# EAGLE design nRF24L01-Chip-v12 (EAGLE 6.1)
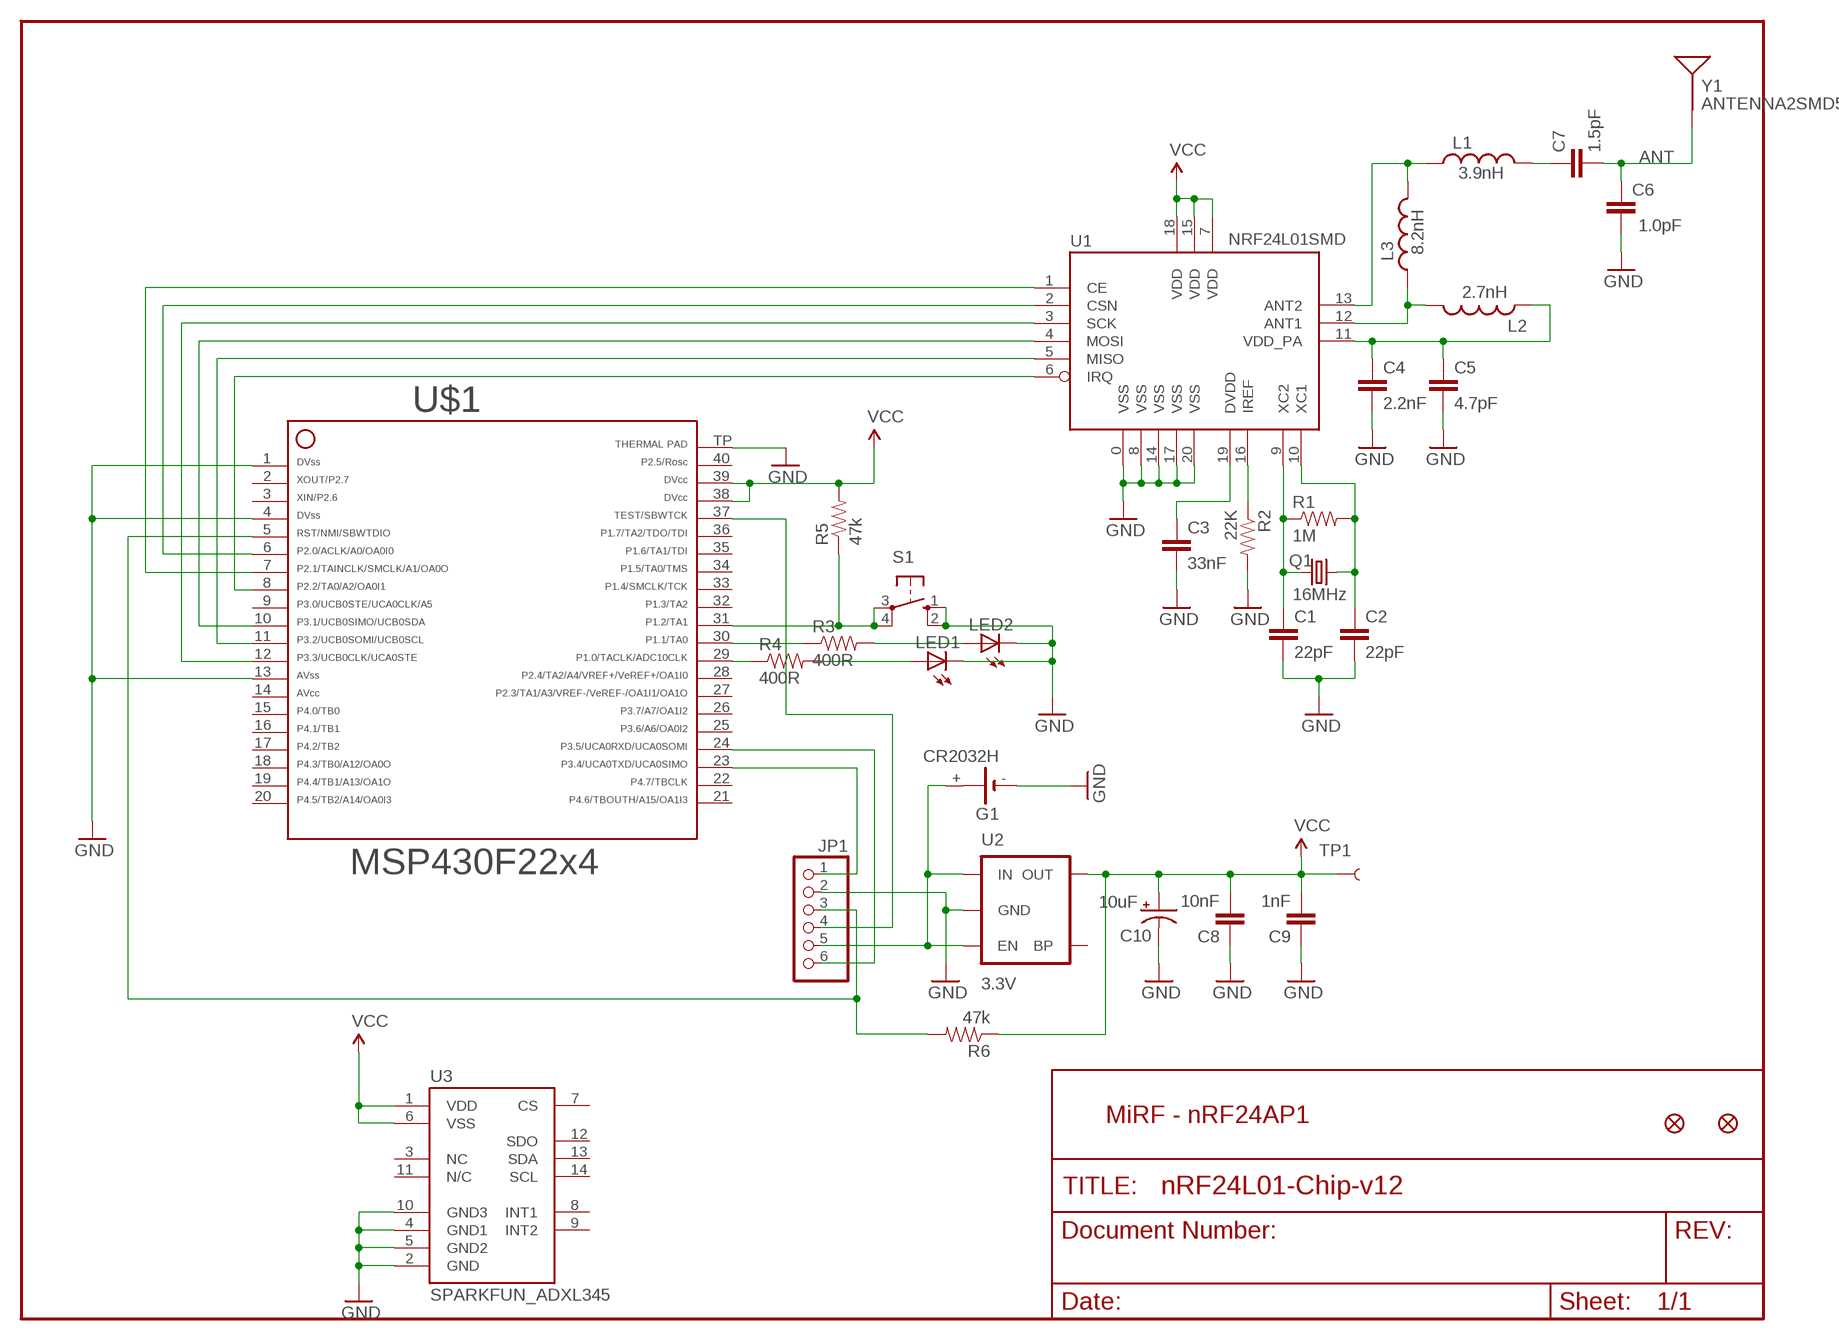
[diagram p0: schematic, sheet 1]

## Parts
C1  22pF  CAP0402  [C0402]
C2  22pF  CAP0402  [C0402]
C3  33nF  CAP0402  [C0402]
C4  2.2nF  CAP0402  [C0402]
C5  4.7pF  CAP0402  [C0402]
C6  1.0pF  CAP0402  [C0402]
C7  1.5pF  CAP0402  [C0402]
C8  10nF  CAP0402  [C0402]
C9  1nF  CAP0402  [C0402]
C10  10uF  CAP_POL1206  [EIA3216]
G1  CR2032H  [CR2032H]
JP1  PINHD-1X6  [1X06]
L1  3.9nH  INDUCTOR0402  [C0402]
L2  2.7nH  INDUCTOR0402  [C0402]
L3  8.2nH  INDUCTOR0402  [C0402]
LED1  LEDCHIPLED_0805  [CHIPLED_0805]
LED2  LEDCHIPLED_0805  [CHIPLED_0805]
Q1  16MHz  CRYSTAL5X3  [CRYSTAL-SMD-5X3]
R1  1M  RESISTOR0402  [C0402]
R2  22K  RESISTOR0402  [C0402]
R3  400R  RESISTOR0402  [C0402]
R4  400R  RESISTOR0402  [C0402]
R5  47k  RESISTOR0402  [C0402]
R6  47k  RESISTOR0402  [C0402]
S1  10-XX  [B3F-10XX]
TP1  TEST-POINT3X5  [PAD.03X.05]
U1  NRF24L01SMD  [QFN20]
U2  3.3V  V_REG_LDOSMD  [SOT23-5]
U3  SPARKFUN_ADXL345  [SPARKFUN_LGA14]
U$1  F22X4---RHA40  [RHA40]
U$2  FIDUCIAL1X2  [FIDUCIAL-1X2]
U$3  FIDUCIAL1X2  [FIDUCIAL-1X2]
Y1  ANTENNA2SMD5  [ANTENNA-CHIP5]

## Nets
ANT: C6.2 C7.2 Y1.FEED(SIGNAL)
GND: C1.2 C2.2 C3.2 C4.2 C5.2 C6.1 C8.1 C9.1 C10.C(-) G1.- JP1.2 LED1.C LED2.C R2.2 S1.1(S) S1.2(S1) U1.0(VSS) U1.8(VSS) U1.14(VSS) U1.17(VSS) U1.20(VSS) U2.2(GND) U3.2(GND) U3.4(GND1) U3.5(GND2) U3.10(GND3) U$1.1 U$1.4 U$1.13 U$1.TP
N$1: C1.1 Q1.1 R1.1 U1.9(XC2)
N$2: C2.1 Q1.3 R1.2 U1.10(XC1)
N$3: L2.2 L3.1 U1.12(ANT1)
N$4: R2.1 U1.16(IREF)
N$5: C3.1 U1.19(DVDD)
N$6: L1.1 L3.2 U1.13(ANT2)
N$7: C4.1 C5.1 L2.1 U1.11(VDD_PA)
N$8: U1.4(MOSI) U$1.10
N$9: C7.1 L1.2
N$10: U1.5(MISO) U$1.11
N$11: U1.3(SCK) U$1.12
N$12: U1.2(CSN) U$1.6
N$13: U1.1(CE) U$1.7
N$14: R4.1 U$1.29
N$15: U1.6(IRQ) U$1.8
N$16: R3.1 U$1.30
N$17: LED2.A R3.2
N$18: LED1.A R4.2
N$19: R5.1 S1.3(P) S1.4(P1) U$1.31
N$21: JP1.1 U$1.23
N$22: JP1.6 U$1.24
N$23: JP1.4 U$1.37
N$24: JP1.3 R6.2 U$1.5
RAW: G1.+ JP1.5 U2.1(IN) U2.3(EN)
VCC: C8.2 C9.2 C10.A(+) R5.2 R6.1 TP1.P$1 U1.7(VDD) U1.15(VDD) U1.18(VDD) U2.5(OUT) U3.1(VDD) U3.6(VSS) U$1.38 U$1.39
Unconnected: G1.+@1(+) U2.4(BP) U3.3(NC) U3.7(CS) U3.8(INT1) U3.9(INT2) U3.11(N/C) U3.12(SDO) U3.13(SDA) U3.14(SCL) U$1.2 U$1.3 U$1.9 U$1.15 U$1.16 U$1.17 U$1.18 U$1.19 U$1.20 U$1.21 U$1.22 U$1.25 U$1.26 U$1.27 U$1.28 U$1.32 U$1.33 U$1.34 U$1.35 U$1.36 U$1.40

## Notes on the sheet
- MiRF - nRF24AP1

## Power pins joined to a net without a drawn wire
14: U$1.14

## Library data of the parts
C1-C9 = SparkFun:CAP: Capacitor Standard 0603 ceramic capacitor, and 0.1" leaded capacitor.
C10 = SparkFun:CAP_POL: Capacitor Polarized These are standard SMD and PTH capacitors. Normally 10uF, 47uF, and 100uF in electrolytic and tantalum varieties. Always verify the external diameter of the through hole cap, it varies with capacity, voltage, and manufacturer. The EIA devices should be standard.
G1 = battery:CR2032H: LI BATTERY Varta
JP1 = pinhead:PINHD-1X6: PIN HEADER
L1-L3 = SparkFun:INDUCTOR: Inductors Basic Inductor/Choke - 0603 and 1206. Footprints are not proven and vary greatly between part numbers.
LED1 LED2 = led:LED: LED OSRAM: - CHIPLED LG R971, LG N971, LY N971, LG Q971, LY Q971, LO R971, LY R971 LH N974, LH R974 LS Q976, LO Q976, LY Q976 LO Q996 - Hyper CHIPLED LW Q18S LB Q993, LB Q99A, LB R99A - SideLED LS A670, LO A670, LY A670, LG A670, LP A670 LB A673, LV A673, LT A673, LW A673 LH A674 LY A675 LS A676, LA A676, LO A676, LY A676, LW A676 LS A679, LY A679, LG A679 - Hyper Micro SIDELED® LS Y876, LA Y876, LO Y876, LY Y876 LT Y87S - SmartLED LW L88C, LW L88S LB L89C, LB L89S, LG L890 LS L89K, LO L89K, LY L89K LS L896, LA L896, LO L896, LY L896 - TOPLED LS T670, LO T670, LY T670, LG T670, LP T670 LSG T670, LSP T670, LSY T670, LOP T670, LYG T670 LG T671, LOG T671, LSG T671 LB T673, LV T673, LT T673, LW T673 LH T674 LS T676, LA T676, LO T676, LY T676, LB T676, LH T676, LSB T676, LW T676 LB T67C, LV T67C, LT T67C, LS T67K, LO T67K, LY T67K, LW E67C LS E67B, LA E67B, LO E67B, LY E67B, LB E67C, LV E67C, LT E67C LW T67C LS T679, LY T679, LG T679 LS T770, LO T770, LY T770, LG T770, LP T770 LB T773, LV T773, LT T773, LW T773 LH T774 LS E675, LA E675, LY E675, LS T675 LS T776, LA T776, LO T776, LY T776, LB T776 LHGB T686 LT T68C, LB T68C - Hyper Mini TOPLED® LB M676 - Mini TOPLED Santana® LG M470 LS M47K, LO M47K, LY M47K Source: http://www.osram.convergy.de LUXEON: - LUMILED® LXK2-PW12-R00, LXK2-PW12-S00, LXK2-PW14-U00, LXK2-PW14-V00 LXK2-PM12-R00, LXK2-PM12-S00, LXK2-PM14-U00 LXK2-PE12-Q00, LXK2-PE12-R00, LXK2-PE12-S00, LXK2-PE14-T00, LXK2-PE14-U00 LXK2-PB12-K00, LXK2-PB12-L00, LXK2-PB12-M00, LXK2-PB14-N00, LXK2-PB14-P00, LXK2-PB14-Q00 LXK2-PR12-L00, LXK2-PR12-M00, LXK2-PR14-Q00, LXK2-PR14-R00 LXK2-PD12-Q00, LXK2-PD12-R00, LXK2-PD12-S00 LXK2-PH12-R00, LXK2-PH12-S00 LXK2-PL12-P00, LXK2-PL12-Q00, LXK2-PL12-R00 Source: www.luxeon.com KINGBRIGHT: KA-3528ASYC Source: www.kingbright.com
Q1 = SparkFun:CRYSTAL: Crystals Various standard crystals. Proven footprints. Spark Fun Electronics SKU : COM-00534
R1-R6 = SparkFun:RESISTOR: Resistor Basic schematic elements and footprints for 0603, 1206, and PTH 1/10th watt (small) resistors.
S1 = switch-omron:10-XX: OMRON SWITCH; MPN: B3F-1000; OC_FARNELL: 176432; OC_NEWARK: 36M3542
TP1 = SparkFun:TEST-POINT
U1 = SparkFun:NRF24L01: 2.4GHz Low Power Transceiver This is the very popular, low cost, very low power RF transceiver from Nordic Semiconductor. Simple SPI interface. SKU: COM-00690
U2 = SparkFun:V_REG_LDO: Voltage Regulator LDO Standard 150mA LDO voltage regulator in SOT-23 layout. Micrel part MIC5205. BP (by-pass) pin is used to lower output noise with 470pF cap.
U3 = ADXL345-BreakoutBoard-v13:SPARKFUN_ADXL345
U$1 = TI_MSP430_v16:F22X4---RHA40: ***MSP430F22x4***RHA40
U$2 U$3 = SparkFun:FIDUCIAL: Fiducial Alignment Points Various fiducial points for machine vision alignment.
Y1 = SparkFun:ANTENNA2: Antenna Single endded antenna. Common with smaller chip antennas. CHIP4 package is the GPS Chip Antenna SKU: GPS-08418. CHIP5 package is 2.4GHz chip antenna SKU: WRL-00144.

## Board
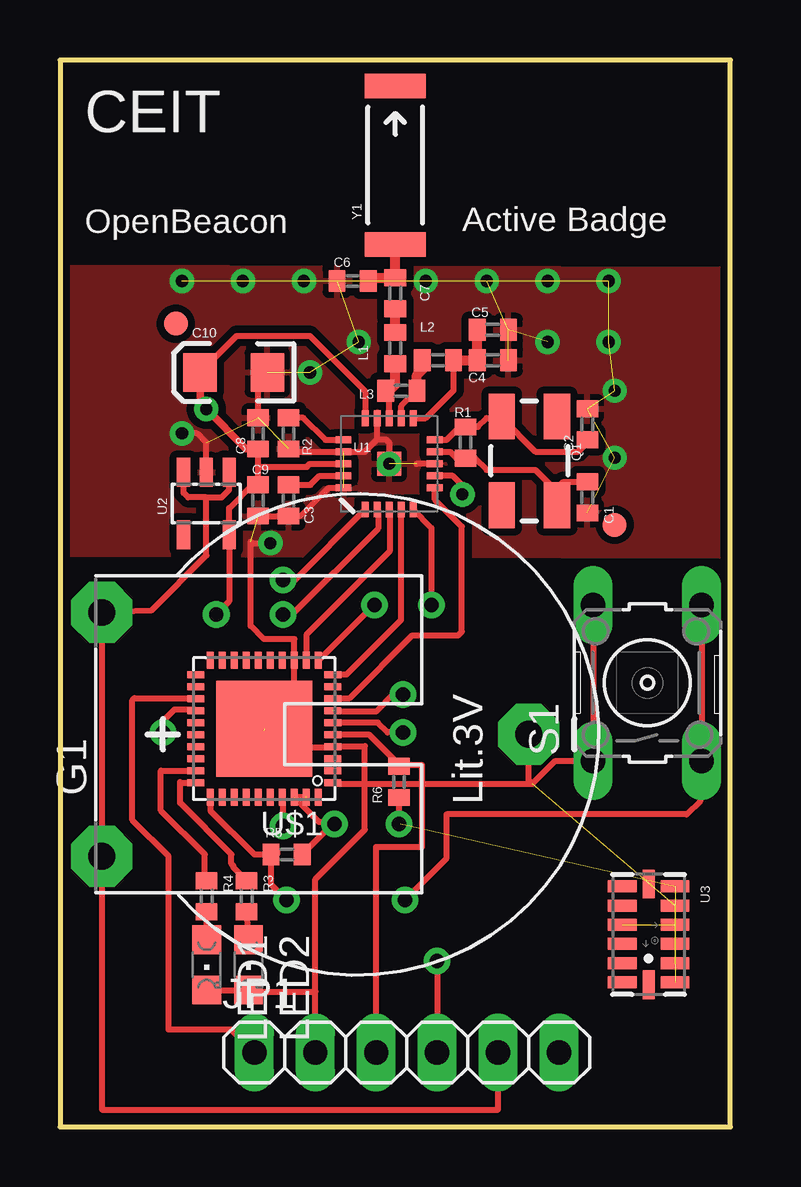
[diagram p1: board, top side]
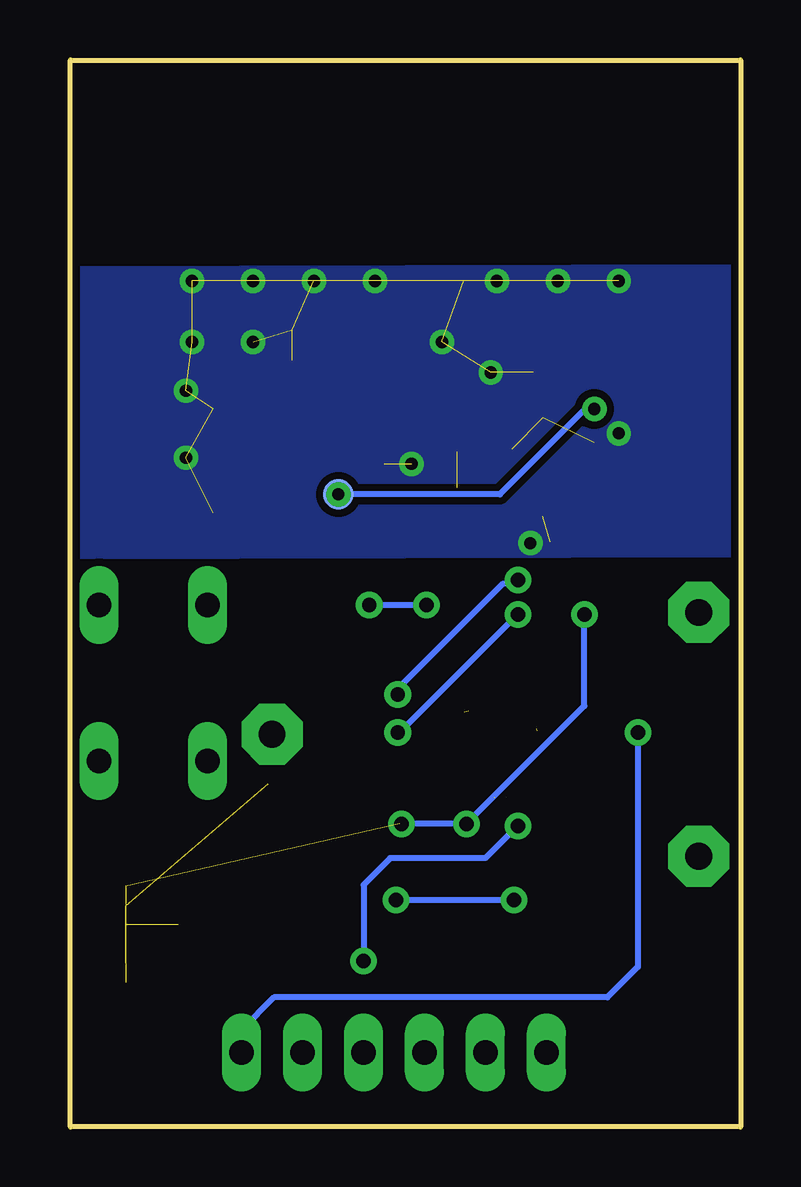
[diagram p2: board, bottom side, seen from below]

Size 27.93 x 44.45 mm. Coordinates in mm from the lower left corner, seen from the top.
Outline: 0,0 27.93,0 27.93,44.45 0,44.45 0,0
Copper layers (1*16): Top 0.035mm / dielectric 1.5mm / Bottom 0.035mm
Design rules: minimum track width 8mil, minimum drill 20mil, track to track 8mil, track to pad 8mil, pad to pad 7mil, via to via 8mil, smd to smd 8mil, copper to edge 10mil, drill to drill 8mil, minimum pad ring 12mil, minimum via ring 10mil, stop-mask expansion 4mil, vias tented up to drill 20mil, thermal gap 10mil

### Footprints (pad centres in the part's own frame; a part is rotated, then mirrored left to right if it is on the bottom)
C0402 = smd 0.7 x 0.9: 1 -0.65,0; 2 0.65,0
EIA3216 = smd 1.4 x 1.6: A 1.4,0; C -1.4,0
CR2032H = drill 1.118 pad 2.54 octagon: + 5.08,10.795; +@1 -5.08,10.795; - 0,-6.985
1X06 = drill 1.016 long: 1 -6.35,0; 2 -3.81,0; 3 -1.27,0; 4 1.27,0; 5 3.81,0; 6 6.35,0
CHIPLED_0805 = smd 1.2 x 1.2: A 0,-1.05; C 0,1.05
CRYSTAL-SMD-5X3 = smd 1.9 x 1.1: 1 -1.85,-1.15; 2 1.85,-1.15; 3 1.85,1.15; 4 -1.85,1.15
B3F-10XX = drill 1.016 long: 1 -3.251,2.261; 2 3.251,2.261; 3 -3.251,-2.261; 4 3.251,-2.261
PAD.03X.05 = smd 1.27 x 1.27: P$1 0,0
QFN20 = smd 1 x 1: 0 0,0 | smd 0.65 x 0.3: 1 -1.9,1; 2 -1.9,0.5; 3 -1.9,0; 4 -1.9,-0.5; 5 -1.9,-1; 11 1.9,-1; 12 1.9,-0.5; 13 1.9,0; 14 1.9,0.5; 15 1.9,1 | smd 0.3 x 0.65: 6 -1,-1.9; 7 -0.5,-1.9; 8 0,-1.9; 9 0.5,-1.9; 10 1,-1.9; 16 1,1.9; 17 0.5,1.9; 18 0,1.9; 19 -0.5,1.9; 20 -1,1.9
SOT23-5 = smd 0.55 x 1.2: 1 -0.95,-1.3; 2 0,-1.3; 3 0.95,-1.3; 4 0.95,1.3; 5 -0.95,1.3
SPARKFUN_LGA14 = smd 0.5 x 1.2: 1 2,1.1; 2 1.2,1.1; 3 0.4,1.1; 4 -0.4,1.1; 5 -1.2,1.1; 6 -2,1.1; 8 -2,-1.1; 9 -1.2,-1.1; 10 -0.4,-1.1; 11 0.4,-1.1; 12 1.2,-1.1; 13 2,-1.1 | smd 1.2 x 0.5: 7 -2.1,0; 14 2.1,0
RHA40 = smd 0.7 x 0.3: 1 -2.85,2.25; 2 -2.85,1.75; 3 -2.85,1.25; 4 -2.85,0.75; 5 -2.85,0.25; 6 -2.85,-0.25; 7 -2.85,-0.75; 8 -2.85,-1.25; 9 -2.85,-1.75; 10 -2.85,-2.25; 21 2.85,-2.25; 22 2.85,-1.75; 23 2.85,-1.25; 24 2.85,-0.75; 25 2.85,-0.25; 26 2.85,0.25; 27 2.85,0.75; 28 2.85,1.25; 29 2.85,1.75; 30 2.85,2.25 | smd 0.3 x 0.7: 11 -2.25,-2.85; 12 -1.75,-2.85; 13 -1.25,-2.85; 14 -0.75,-2.85; 15 -0.25,-2.85; 16 0.25,-2.85; 17 0.75,-2.85; 18 1.25,-2.85; 19 1.75,-2.85; 20 2.25,-2.85; 31 2.25,2.85; 32 1.75,2.85; 33 1.25,2.85; 34 0.75,2.85; 35 0.25,2.85; 36 -0.25,2.85; 37 -0.75,2.85; 38 -1.25,2.85; 39 -1.75,2.85; 40 -2.25,2.85 | smd 4 x 4: TP 0,0
FIDUCIAL-1X2 = smd 1 x 1: 1 0,0
ANTENNA-CHIP5 = smd 1.016 x 2.54: FEED -3.302,0; NC 3.302,0

### Placement (x,y rotation side)
C1  21.97,26.23 270 top
C2  21.97,29.27 90 top
C3  9.53,26.1 270 top
C4  18.03,31.94 0 top
C5  18.03,33.21 0 top
C6  12.19,35.24 0 top
C7  13.97,34.73 90 top
C8  8.26,28.89 270 top
C9  8.26,26.1 90 top
C10  7.24,31.43 180 top
G1  12.54,16.35 90 top
JP1  14.45,3.1 0 top
L1  13.97,32.45 90 top
L2  15.75,31.94 180 top
L3  14.22,30.67 180 top
LED1  6.11,6.75 180 top
LED2  7.86,6.75 180 top
Q1  19.56,27.75 90 top
R1  16.89,28.51 90 top
R2  9.53,28.89 270 top
R3  7.78,9.6 270 top
R4  6.11,9.6 270 top
R5  9.45,11.35 0 top
R6  14.13,14.37 90 top
S1  24.48,18.5 90 top
TP1  16.76,26.35 0 bottom
U1  13.72,27.62 90 top
U2  6.1,25.97 180 top
U3  24.53,8.02 270 top
U$1  8.51,16.59 180 top
U$2  23.11,25.08 0 top
U$3  4.83,33.46 0 top
Y1  13.97,40.07 90 top

### Tracks (layer width: path | path; a pad name or v marks a point on that pad's centre or on a via)
ANT
  Top 0.203: C6.2 12.95,35.24 13.09,35.38
  Top 0.406: 13.09,35.38 C7.2 13.97,35.5 Y1.FEED
GND  (via drill 0.51)  (29 unrouted)
  Top 0.203: 11.94,28.13 11.93,28.12 U1.17 | 9.51,25.45 10.02,25.45 10.92,26.35
  Top 0.254: C10.C 8.26,31.18 C8.1 | C3.2 9.53,25.46 9.51,25.45 C9.1 | 13.21,28.65 U1.14 | 13.21,28.65 13.58,28.65 13.72,28.51 U1.0 | U1.8 14.86,27.62 | 11.93,28.12 12.69,28.12 13.21,28.65 | R2.2 9.53,28.26 9.65,28.13 11.94,28.13 | 10.92,26.35 11.19,26.62 U1.20 | v5.08,28.89 5.71,28.89 6.1,28.51 U2.2 | JP1.2 10.64,5.64 | 10.64,5.64 10.64,10.32 12.7,12.38 12.7,14.29 | 12.7,14.29 12.7,15.88 12.66,15.84 U$1.4 11.32,15.8 9.68,15.8 9.76,15.87 U$1.13 | U$1.1 11.41,14.29 12.7,14.29 | U$1.13 9.76,20.32 8.49,20.32 7.94,20.88 7.94,24.37 7.99,24.32 v8.76,24.32 | 8.49,16.51 9.76,16.51 U$1.13 | LED1.C LED2.C 8.4,5.64 10.64,5.64 | 12.7,14.29 19.68,14.29 | 19.68,14.29 19.53,14.45 G1.- | 19.68,14.29 20.64,15.25 S1.1 S1.2
  other vias: 13.72,27.62 5.08,35.24 7.62,35.24 10.16,35.24 10.41,31.43 12.45,32.7 15.24,35.24 17.78,35.24 20.32,35.24 22.86,35.24 20.32,32.7 22.86,32.7 23.11,30.67 23.11,27.88
  pour Bottom (isolate 0.305): 0.16,23.84 0.16,35.83 27.78,35.75 27.78,23.76
  pour Top (isolate 0.305): 0.16,23.84 0.16,35.83 27.78,35.75 27.78,23.76
N$1
  Top 0.254: U1.9 16.26,28.12 16.51,27.88 16.89,27.88 R1.1 17.29,27.86 17.78,27.37 19.81,27.37 20.64,26.54 | 20.64,26.54 20.7,26.48 20.7,26.23 | 20.7,26.23 20.7,25.97 20.71,25.96 Q1.1 | 20.7,26.23 20.83,26.23 21.1,26.49 | 20.64,26.54 20.57,26.48 | C1.1 20.97,26.88 20.64,26.54
N$2
  Top 0.254: U1.10 16.11,28.62 16.51,29.02 16.76,29.02 16.89,29.15 R1.2 17.41,29.16 17.78,29.53 18.29,29.53 18.41,29.65 | 18.41,29.65 18.41,30.04 | 18.41,29.65 Q1.3 18.41,29.54 19.81,28.13 21.59,28.13 21.97,28.51 C2.1
N$3
  Top 0.254: L3.1 14.22,30.04 14.22,29.65 14.21,29.65 U1.12
  Top 0.406: L3.1 14.87,31.32 15.11,31.56 15.11,31.94 L2.2
N$4
  Top 0.254: U1.16 11.06,28.62 10.14,29.54 R2.1
N$5
  Top 0.254: U1.19 10.8,27.12 10.43,26.75 C3.1
N$6
  Top 0.203: 13.59,30.67 13.72,30.67
  Top 0.254: L3.2 13.59,30.67 13.71,30.54 U1.13
  Top 0.406: L1.1 13.97,30.93 13.72,30.67
N$7
  Top 0.203: 17.38,31.92 | C4.1 17.38,31.92 | 17.38,31.92
  Top 0.254: U1.11 15.24,29.52 16.4,30.69 L2.1
  Top 0.406: 17.38,31.92 C5.1 | 17.4,31.94 | 17.4,31.94 C4.1 | L2.1 17.4,31.94
N$8
  Top 0.254: U1.4 14.21,25.72 14.21,21.11 11.93,18.84 U$1.10
N$9
  Top 0.203: C7.1 13.97,33.97
  Top 0.406: L1.2 13.97,33.97
N$10  (via drill 0.6)
  Top 0.254: U1.5 15.48,24.96 v15.48,21.75 | v13.1,21.75 10.78,19.44 U$1.11
  Bottom 0.254: v15.48,21.75 v13.1,21.75
N$11
  Top 0.254: U1.3 13.73,25.71 13.73,23.97 10.26,20.5 U$1.12
N$12  (via drill 0.6)
  Top 0.254: U1.2 13.26,25.68 13.26,24.92 9.68,21.35 v9.29,21.35 | v14.29,16.43 13.65,16.43 13.25,16.84 U$1.6
  Bottom 0.254: v9.29,21.35 14.21,16.43 v14.29,16.43
N$13  (via drill 0.6)  (1 unrouted)
  Top 0.254: U1.1 9.77,22.78 v9.29,22.78 | v14.29,18.02 13.89,18.02 13.18,17.3 11.51,17.3
  Bottom 0.254: v9.29,22.78 9.45,22.62 9.92,22.62 14.29,18.26 v14.29,18.02
N$14
  Top 0.254: R4.1 6.03,10.41 6.03,11.35 4.21,13.18 4.21,14.84 U$1.29
N$15
  Top 0.254: U$1.8 11.38,17.86 12.06,17.86 14.68,20.48 16.59,20.48 16.75,20.64 16.75,25 15.62,26.14 U1.6
N$16
  Top 0.254: U$1.30 5.03,14.34 5,14.37 5,13.49 7.14,11.35 7.14,10.95 7.22,10.87 7.22,10.81 R3.1
N$17
  Top 0.254: LED2.A 7.86,7.88 R3.2
N$18
  Top 0.254: LED1.A R4.2
N$19  (via drill 0.6)
  Top 0.254: U$1.31 6.27,13.73 6.27,13.18 8.1,11.35 R5.1 | S1.4 S1.3 26.67,15.18 26.67,13.57 26.11,13.02 16.11,13.02 16.11,11.19 v14.37,9.45 | R5.1 9.05,11.57 9.05,11.35 | v9.45,9.45 8.8,10.1 R5.1
  Bottom 0.254: v9.45,9.45 v14.37,9.45
N$21
  Top 0.254: JP1.1 7.14,4.05 4.52,4.05 4.52,11.27 3.02,12.78 3.02,17.78 3.1,17.86 5.64,17.86 U$1.23
N$22  (via drill 0.6)
  Top 0.254: U$1.24 5.62,17.38 4.76,17.38 4.29,16.91 v4.29,16.43
  Bottom 0.254: v4.29,16.43 4.29,6.67 5.56,5.4 19.45,5.4 20.8,4.05 JP1.6
N$23  (via drill 0.6)
  Top 0.254: U$1.37 9.29,13.71 v9.29,12.54 | v15.72,6.91 JP1.4
  Bottom 0.254: v9.29,12.54 10.64,11.19 14.61,11.19 15.72,10.08 v15.72,6.91
N$24
  Top 0.254: U$1.5 11.38,16.35 12.86,16.35 14.13,15.08 R6.2 14.19,15.08 15.08,15.08 15.08,11.67 13.18,11.67 JP1.3
RAW
  Top 0.254: U2.1 7.05,26.54 6.73,26.23 6.1,26.23 | 6.1,26.23 5.33,26.23 5.15,26.41 U2.3 | 6.1,26.23 6.1,23.81 3.79,21.51 G1.+ 1.75,0.71 18.26,0.71 JP1.5
VCC  (via drill 0.51, 0.6)  (4 unrouted)
  Top 0.203: 12.71,29.64 U1.15
  Top 0.254: U1.18 10.41,27.62 10.29,27.5 8.26,27.5 | 8.26,27.5 C9.2 8.02,26.75 7.05,25.78 U2.5 7.05,21.89 v6.51,21.35 | 8.26,27.5 8.26,28.26 | 12.71,29.64 12.71,30.66 10.41,32.96 7.37,32.96 C10.A | U1.7 16.37,27.12 16.76,26.73 TP1.P$1 | 10.24,13.73 U$1.38 | v14.13,12.62 R6.1 | U$1.38 10.79,12.7 11.35,12.7 v11.43,12.62 11.37,12.62 R5.2
  Top 0.305: C10.A 5.84,30.17 v6.1,29.91 7.75,28.26 8.26,28.26 C8.2
  Bottom 0.254: TP1.P$1 10.03,26.35 6.48,29.91 v6.1,29.91 | 14.21,12.62 v14.13,12.62 v11.43,12.62 6.51,17.54 v6.51,21.35
  other vias: 16.76,26.35

### Text on the board
tValues: DNP
_tsilk: CEIT | OpenBeacon | Active Badge